# EAGLE design DCC-headlight-V1 (EAGLE 7.4.0)
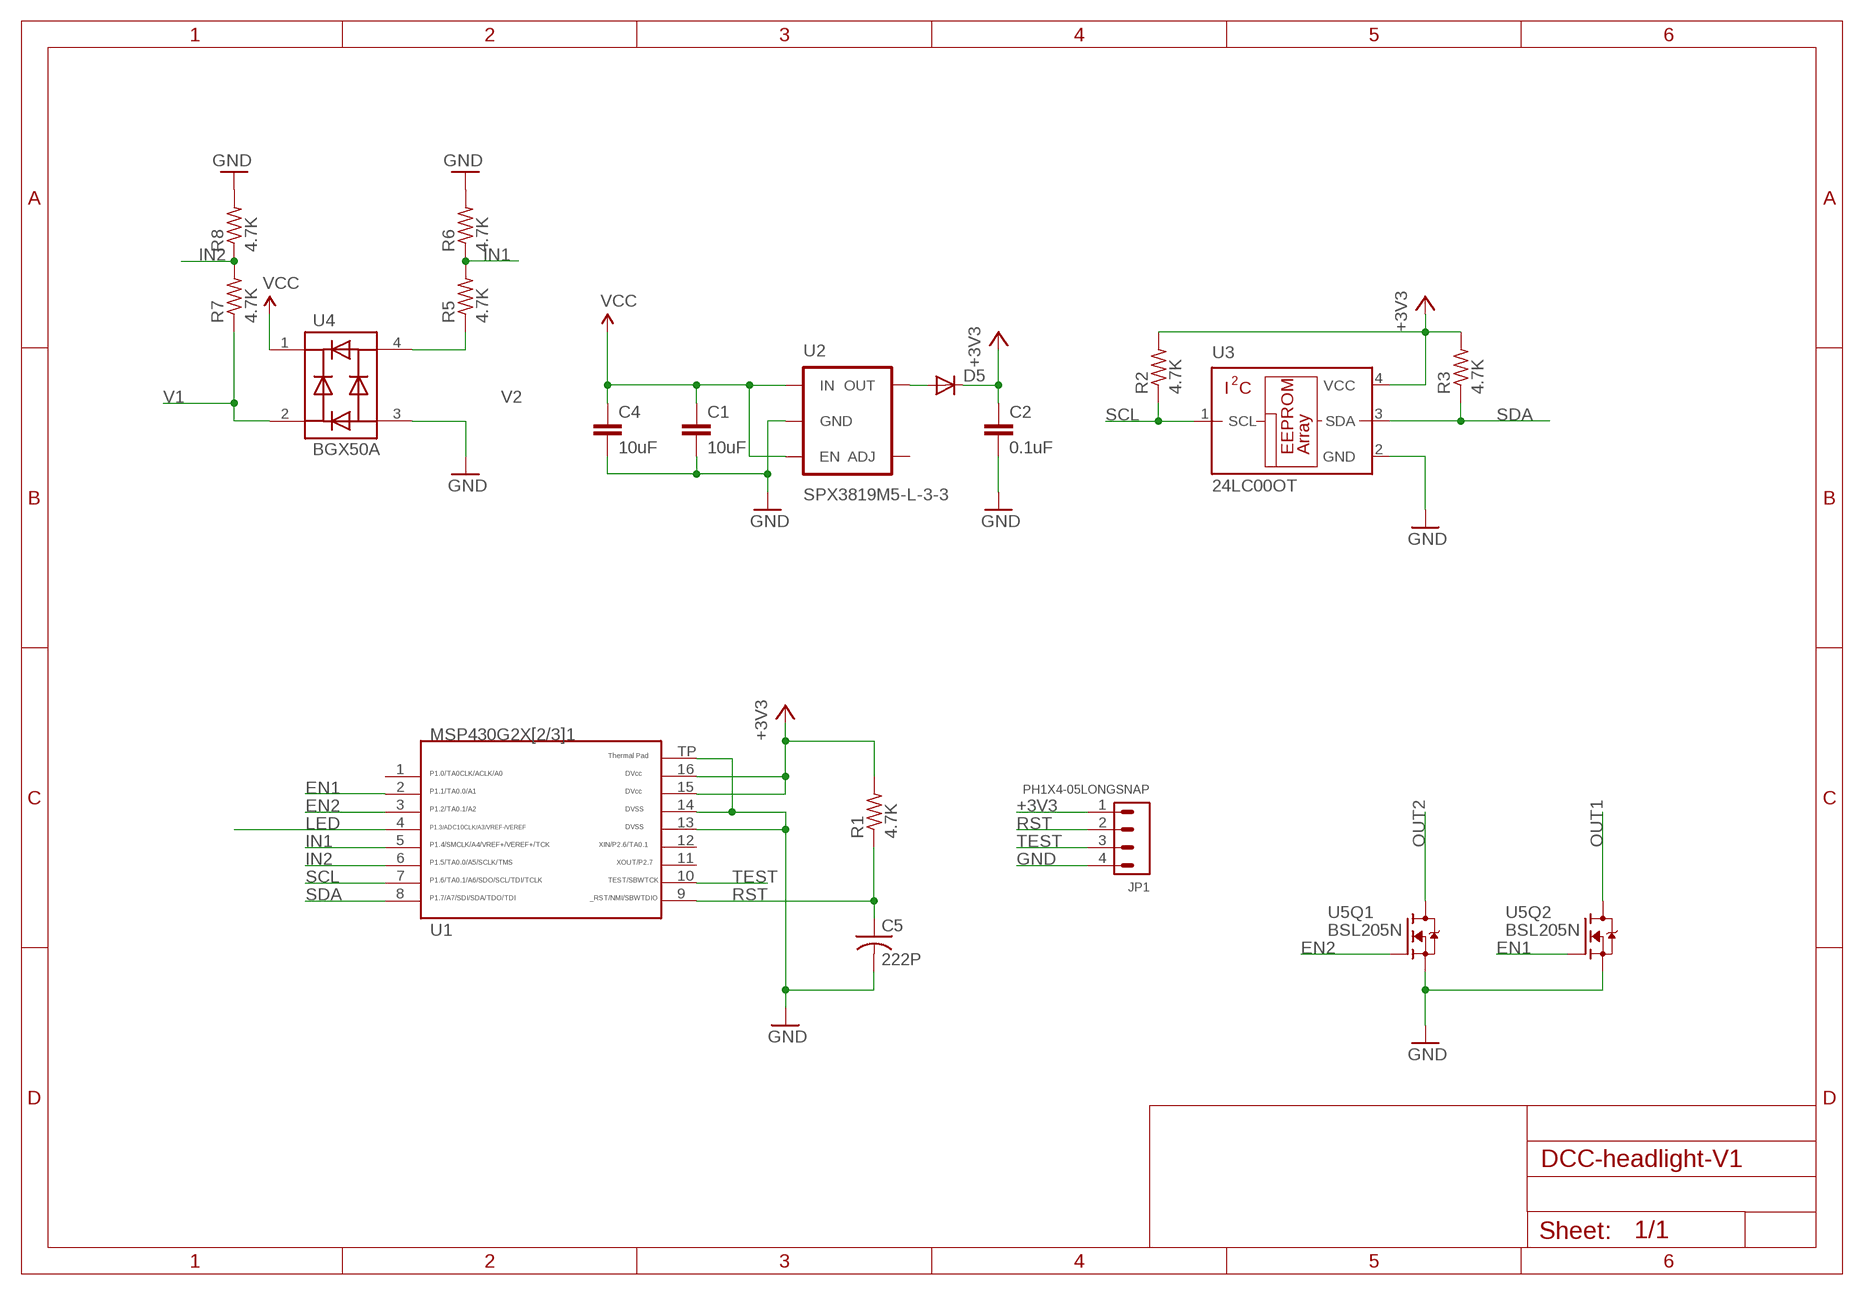
[diagram p0: schematic, sheet 1]

## Parts
C1  10uF  CAP0402-CAP  [0402-CAP]
C2  0.1uF  CAP0402-CAP  [0402-CAP]
C4  10uF  CAP0402-CAP  [0402-CAP]
C5  222P  C-USC0402  [C0402]
D5  DIODE-SOD523  [SOD523]
JP1  PH1X4-05LONGSNAP  [PHLS005-1-4]
R1  4.7K  R-US_R0402  [R0402]
R2  4.7K  R-US_R0402  [R0402]
R3  4.7K  R-US_R0402  [R0402]
R5  4.7K  R-US_R0402  [R0402]
R6  4.7K  R-US_R0402  [R0402]
R7  4.7K  R-US_R0402  [R0402]
R8  4.7K  R-US_R0402  [R0402]
U1  G2X[2/3]1---RSA16  [RSA16]
U2  SPX3819M5-L-3-3  AP2202-ADJ  [SOT23-5]
U3  24LC00OT  [SOT23-5L]
U4  BGX50A  [SOT143]
U5  BSL205N  [SOT23-6]

## Nets
+3V3: C2.1 D5.C JP1.1 R1.2 R2.2 R3.2 U1.15 U1.16 U3.4(VCC)
EN1: U1.2 U5.3(Q2:G)
EN2: U1.3 U5.1(Q1:G)
GND: C1.2 C2.2 C4.2 C5.2 JP1.4 R6.2 R8.2 U1.13 U1.14 U1.TP U2.2(GND) U3.2(GND) U4.3 U5.2(Q2:S) U5.5(Q1:S)
IN1: R5.2 R6.1 U1.5
IN2: R7.2 R8.1 U1.6
LED: U1.4
N$1: D5.A U2.5(OUT)
OUT1: U5.4(Q2:D)
OUT2: U5.6(Q1:D)
RST: C5.1 JP1.2 R1.1 U1.9
SCL: R2.1 U1.7 U3.1(SCL)
SDA: R3.1 U1.8 U3.3(SDA)
TEST: JP1.3 U1.10
V1: R7.1 U4.2
V2: R5.1 U4.4
VCC: C1.1 C4.1 U2.1(IN) U2.3(EN) U4.1
Unconnected: U1.1 U1.11 U1.12 U2.4(ADJ)

## Library data of the parts
C1 C2 C4 = SparkFun-Passives:CAP: Capacitor Standard 0603 ceramic capacitor, and 0.1" leaded capacitor.
C5 = adafruit:C-US: CAPACITOR, American symbol
D5 = RoboJackets-Diodes:DIODE-: DIODE
JP1 = pel_hdr:PH1X4
R1-R3 R5-R8 = rcl:R-US_: RESISTOR, American symbol
U1 = TI_MSP430_v16:G2X[2/3]1---RSA16: MSP430G2X[2/3]1 QFN (RSA) 16 Pin Package http://focus.ti.com/docs/prod/folders/print/msp430g2221.html
U2 = SparkFun-PowerIC:AP2202-ADJ: AP2202 Adjustable LDO Diodes Inc small, low-cost LDO 150mA, 13.2V, less than 200mV dropout; PROD_ID: VREG-12189; VALUE: AP2202-ADJ
U3 = microchip:24*00: Serial EEPROM 128 bit, I2C (AA = 1.8 V/LC = 2.5 V/C = 5.0 V); MF: MICROCHIP; MPN: 24LC00T-I/OT; OC_FARNELL: 9757864; OC_NEWARK: 62K0574
U4 = semicon-smd-ipc:BGX50A
U5 = transistor-fet:BSL205N

## Board
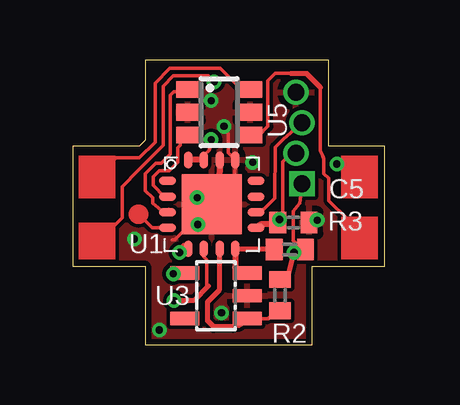
[diagram p1: board, top side]
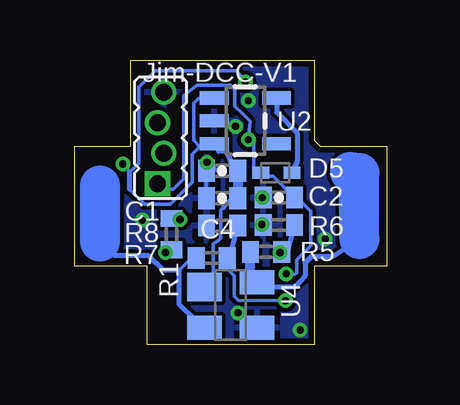
[diagram p2: board, bottom side, seen from below]

Size 13 x 11.86 mm. Coordinates in mm from the lower left corner, seen from the top.
Outline: 3.02,0 9.98,0 9.98,3.25 13,3.25 13,8.25 10.67,8.25 10.67,11.86 3.02,11.86 3.02,8.51 2.77,8.25 0,8.25 0,3.25 3.02,3.25 3.02,0
Copper layers (1*16): Top 0.035mm / dielectric 1.5mm / Bottom 0.035mm
Design rules "6mil": minimum track width 6mil, minimum drill 6mil, track to track 6mil, track to pad 6mil, pad to pad 6mil, via to via 6mil, smd to smd 6mil, copper to edge 10mil, drill to drill 8mil, minimum pad ring 6mil, minimum via ring 6mil, stop-mask expansion 4mil, vias tented up to drill 15mil, thermal gap 10mil

### Footprints (pad centres in the part's own frame; a part is rotated, then mirrored left to right if it is on the bottom)
0402-CAP = smd 0.7 x 0.9: 1 -0.65,0; 2 0.65,0
C0402 = smd 0.7 x 0.9: 1 -0.65,0; 2 0.65,0
SOD523 = smd 0.7 x 0.5: A 0.7,0; C -0.6,0
PHLS005-1-4 = drill 0.7 pad 1.016 square: 1 0,0.127 | drill 0.7 pad 1.016: 2 1.27,-0.127; 3 2.54,0.127; 4 3.81,-0.127
R0402 = smd 0.7 x 0.9: 1 -0.65,0; 2 0.65,0
RSA16 = smd 0.7 x 0.35: 1 -1.85,0.975; 2 -1.85,0.325; 3 -1.85,-0.325; 4 -1.85,-0.975; 9 1.85,-0.975; 10 1.85,-0.325; 11 1.85,0.325; 12 1.85,0.975 | smd 0.35 x 0.7: 5 -0.975,-1.85; 6 -0.325,-1.85; 7 0.325,-1.85; 8 0.975,-1.85; 13 0.975,1.85; 14 0.325,1.85; 15 -0.325,1.85; 16 -0.975,1.85 | smd 2.5 x 2.5: TP 0,0
SOT23-5 = smd 0.55 x 1.2: 1 -0.95,-1.3; 2 0,-1.3; 3 0.95,-1.3; 4 0.95,1.3; 5 -0.95,1.3
SOT23-5L = smd 0.55 x 1.2: 1 -0.95,-1.3; 2 0,-1.3; 3 0.95,-1.3; 4 0.95,1.3; 5 -0.95,1.3
SOT143 = smd 1.2 x 1.44: 1 -0.75,-1.1 | smd 1 x 1.44: 2 0.95,-1.1; 3 0.95,1.1; 4 -0.95,1.1
SOT23-6 = smd 0.69 x 0.99: 1 -0.95,-1.3; 2 0,-1.3; 3 0.95,-1.3; 4 0.95,1.3; 5 0,1.3; 6 -0.95,1.3

### Placement (x,y rotation side)
C1  6.86,7.24 180 bottom
C2  4.5,6.12 180 bottom
C4  6.86,6.1 180 bottom
C5  9.19,5.08 0 top
D5  4.65,7.16 0 bottom
JP1  9.42,6.71 90 bottom
R1  8.97,4.6 270 bottom
R2  8.64,2.06 90 top
R3  9.04,3.96 0 top
R5  5.03,3.86 0 bottom
R6  4.5,4.98 180 bottom
R7  7.29,3.61 0 bottom
R8  6.86,4.95 180 bottom
U1  5.79,5.84 0 top
U2  5.89,9.32 270 bottom
U3  5.97,2.03 90 top
U4  6.5,1.65 270 bottom
U5  6.1,9.68 270 top

### Tracks (layer width: path | path; a pad name or v marks a point on that pad's centre or on a via)
+3V3  (via drill 0.3)
  Top 0.152: JP1.1 9.45,5.89 9.35,5.77 9.2,5.56 9.2,4.33 R3.2 | v5.77,8.53 5.69,8.1 5.47,7.88 U1.15
  Top 0.203: R2.2 8.93,2.71 v9.22,3.83 9.95,3.72 R3.2
  Top 0.254: U1.15 U1.16 | U3.4 4.39,2.93 v4.19,2.95
  Bottom 0.152: 5.09,7.01 4.72,7.01 4.27,6.55 4.27,6.54 C2.1 3.73,6.12 3.17,5.56 3.17,4.12 3.76,3.53 3.76,3 3.83,2.92 4.14,2.87 v4.19,2.95 | 9.04,6.48 8.89,6.48 8.46,6.91 8.46,10.36 7.92,10.79 6.5,10.79 6.33,10.62 6.33,9.93 5.97,9.6 5.69,9.3 v5.77,8.53 5.54,8.41 5.54,7.09 5.46,7.16 D5.C
  Bottom 0.203: 5.09,7.01 D5.C | v9.22,3.83 9.09,3.77 R1.2 | 9.04,6.48 9.35,6.48 JP1.1
EN1
  Top 0.152: U5.3 4.6,8.68 4.57,8.68 4.47,8.58 4.47,8.31 4.37,8.2 4.37,7.6 4.01,7.24 3.61,7.24 3.35,6.98 3.35,6.63 3.81,6.17 U1.2 3.83,6.2 3.71,6.2
EN2
  Top 0.152: 4.01,5.64 U1.3 3.78,5.52 3.33,5.89 3.33,6.12 3.02,6.4 3.02,7.11 3.45,7.54 3.68,7.54 4.06,7.93 4.06,10.39 4.22,10.54 4.56,10.54 U5.1 4.51,10.49
GND  (via drill 0.3)
  Top 0.152: C5.2 10.08,5.28 v10.19,5.18 | v5.21,5 6.76,6.78 6.76,7.16 6.74,6.85 U1.13 6.48,7.98 6.48,8.79 6.3,8.97 v6.3,9.09 | 4.14,4.37 4.24,4.37 4.57,4.7
  Top 0.254: U1.14 6.09,5.56 U1.TP 5.44,5.44
  Top 0.406: U1.TP 6.17,5.97
  Bottom 0.152: 7.53,5.84 C1.2 7.53,7.43 | 7.53,7.43 v7.49,7.6 | 7.53,7.43 7.25,7.43 6.96,7.14
  Bottom 0.203: U4.3 5.48,0.7 v6.2,1.32
  other vias: 5.18,6.12 3.61,0.61 2.57,4.39 5.77,10.16
  pour Bottom: -3.81,13.21 15.24,13.21 15.24,-0.51 -3.81,-0.51
  pour Top: -3.05,12.7 13.97,12.7 13.97,-1.02 -3.05,-1.02
IN1  (via drill 0.3)
  Top 0.203: U1.5 4.62,4.12 v4.45,3.83
  Bottom 0.203: R5.2 4.24,4.02 v4.45,3.83 4.15,3.87 R6.1
IN2  (via drill 0.3)
  Top 0.152: U1.6 5.44,3.68 5.59,3.53 5.59,2.5 5.64,2.44
  Top 0.203: v4.22,1.83 5.03,1.83 5.64,2.44
  Bottom 0.152: 6.51,3.81 6.51,3.03 6.35,2.87 6.35,2.01 6.2,1.85 v4.22,1.83
  Bottom 0.203: 4.34,1.78 v4.22,1.83 | R8.1 6.51,3.81 R7.2 6.54,3.52 6.5,3.17
LED
  Top 0.152: U1.4 3.31,4.87 2.74,5.44
  Top 0.813: 2.72,5.44 2.74,5.44
N$1
  Bottom 0.203: U2.5 4.59,9.67 3.73,8.81 3.73,7.63 D5.A
OUT1
  Top 0.152: 10.31,10.72 10.31,8.08 10.41,7.87 10.46,7.75 10.46,7.11 10.67,6.93 10.67,5.99 11.43,5.23 | U5.4 7.76,8.73 8.13,9.09 8.13,11 8.43,11.3 9.09,11.3
  Top 0.203: 10.31,10.72 9.73,11.3 9.09,11.3
OUT2
  Top 0.152: 1.63,7.6 1.8,7.77 2.77,7.77 3.43,8.43 3.43,10.9 4.04,11.51 6.15,11.51 7.03,10.63 U5.6
RST  (via drill 0.3)
  Top 0.152: JP1.2 8.97,7.87 9.02,7.9 8.74,7.62 8.74,5.28 | 8.74,5.28 8.64,5 | 8.74,5.28 8.74,5.09 C5.1
  Top 0.203: v8.61,5.21 8.8,5.08 C5.1 8.72,5 8.64,5
  Top 0.254: 8.64,5 7.83,5 U1.9
  Bottom 0.203: R1.1 9.34,5.02 v8.61,5.21
SCL
  Top 0.152: U3.1 8.13,1.08 R2.1
  Top 0.203: U3.1 7,0.9 6.68,0.74 5.87,0.74 5.61,0.99 5.61,1.78 6.12,2.29 6.12,3.95 U1.7
  Top 0.254: 6.9,0.81 U3.1
SDA
  Top 0.203: R3.1 6.85,3.96 U1.8
  Top 0.254: U1.8 6.76,3.21 U3.3
TEST
  Top 0.152: U1.10 7.96,5.64 8.41,6.1 8.43,8.23 8.76,8.56 JP1.3
V1
  Bottom 0.152: R7.1 8.08,3.66 8.64,3.1
  Bottom 0.203: U4.2 8.04,0.7 8.04,1.08 8.64,1.65 8.64,3.1 9.32,3.1 9.93,3.71 11.35,3.71 11.94,4.29 | 8.2,3.45 8.15,3.47 R7.1
  Bottom 1.676: 11.94,4.29 11.94,6.63
V2
  Bottom 0.203: U4.4 4.89,2.6 4.72,2.39 3.83,2.39 3.4,2.87 3.4,3.4 3.12,3.68 2.23,3.68 1.14,4.39
  Bottom 0.406: R5.1 5.73,2.93 U4.4
  Bottom 1.676: 1.14,4.39 1.14,7.14 1.52,7.19
VCC  (via drill 0.3)
  Top 0.152: v5.89,10.95 5.64,11.2 4.19,11.2 3.76,10.77 3.76,8.31 2.72,7.26 2.06,6.58 2.06,5.28 1.57,4.8
  Bottom 0.152: 7.66,8.24 7.78,8.24 | 7.78,8.24 8.1,7.93 8.1,6.76 9.02,5.84 10.08,5.84 10.72,6.48 | U2.1 7.84,10.27 8.05,10.06 8.05,8.51 7.78,8.24 | 6.81,5.71 6.91,5.59 6.91,4.42 7.01,4.32 7.21,4.22 7.24,4.19 7.24,2.87 7.19,2.81 | v5.89,10.95 6.25,11.4 9.65,11.4 10.31,10.74 10.34,10.74 10.34,7.54 10.72,7.16 10.72,7.21 v11,7.52
  Bottom 0.203: 7.66,8.24 U2.3 7,8.05 6.68,8.05 6.38,7.33 C1.1 | 10.72,7.16 10.72,6.48 | C4.1 6.43,6.1 6.81,5.71 | 7.49,2.51 U4.1 7.19,2.81
  Bottom 0.406: C1.1 C4.1
(copper drawn outside any net)
  shapes: Top area x4

### Text on the board
bPlace: Jim-DCC-V1